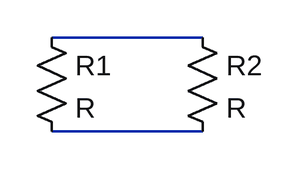
[diagram p0: schematic Draft1.asc]
Draft1.asc, the LTspice schematic file:
Version 4
SHEET 1 880 680
WIRE 320 128 192 128
WIRE 320 208 192 208
SYMBOL res 176 112 R0
SYMATTR InstName R1
SYMBOL res 304 112 R0
SYMATTR InstName R2

The netlist it stands for:
* Draft1.asc
R1 N001 N002 R
R2 N001 N002 R
.backanno
.end